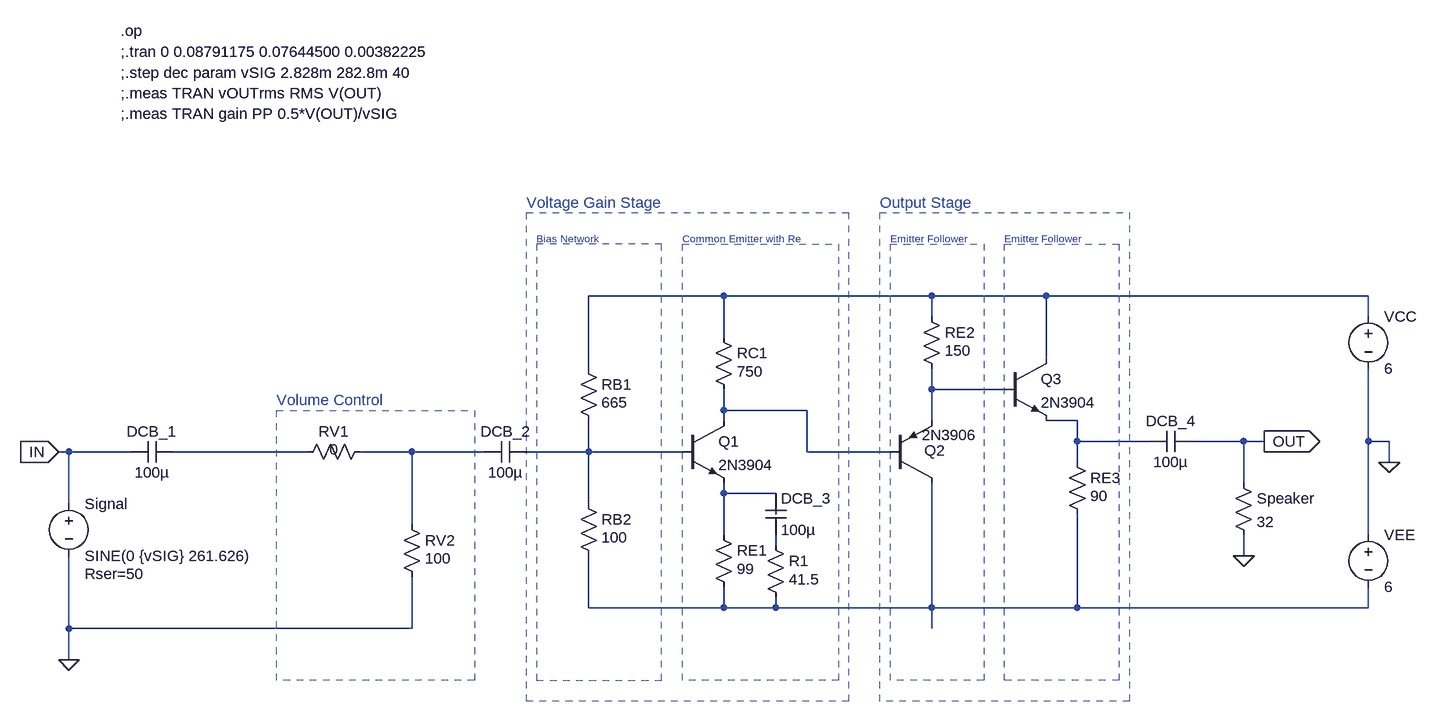
[diagram p0: schematic LabeledAudioAmplifier.asc]
LabeledAudioAmplifier.asc, the LTspice schematic file:
Version 4
SHEET 1 2440 680
WIRE 608 -272 400 -272
WIRE 928 -272 608 -272
WIRE 1104 -272 928 -272
WIRE 1600 -272 1104 -272
WIRE 928 -240 928 -272
WIRE 1600 -240 1600 -272
WIRE 608 -208 608 -272
WIRE 1104 -176 1104 -272
WIRE 400 -160 400 -272
WIRE 928 -128 928 -160
WIRE 1040 -128 928 -128
WIRE 608 -96 608 -128
WIRE 736 -96 608 -96
WIRE 608 -80 608 -96
WIRE 928 -80 928 -128
WIRE 1152 -80 1104 -80
WIRE 1152 -48 1152 -80
WIRE 1264 -48 1152 -48
WIRE 1408 -48 1328 -48
WIRE 1440 -48 1408 -48
WIRE 1600 -48 1600 -160
WIRE 1632 -48 1600 -48
WIRE -400 -32 -416 -32
WIRE -304 -32 -400 -32
WIRE -32 -32 -240 -32
WIRE 128 -32 48 -32
WIRE 240 -32 128 -32
WIRE 400 -32 400 -80
WIRE 400 -32 304 -32
WIRE 544 -32 400 -32
WIRE 736 -32 736 -96
WIRE 864 -32 736 -32
WIRE 1152 -16 1152 -48
WIRE 1632 -16 1632 -48
WIRE 1408 16 1408 -48
WIRE 608 32 608 16
WIRE 688 32 608 32
WIRE -400 48 -400 -32
WIRE 400 48 400 -32
WIRE 688 64 688 48
WIRE 128 80 128 -32
WIRE 608 96 608 32
WIRE 1600 96 1600 -48
WIRE 688 112 688 96
WIRE 1408 128 1408 96
WIRE 400 208 400 128
WIRE 608 208 608 176
WIRE 608 208 400 208
WIRE 688 208 688 192
WIRE 688 208 608 208
WIRE 928 208 928 16
WIRE 928 208 688 208
WIRE 1152 208 1152 64
WIRE 1152 208 928 208
WIRE 1600 208 1600 176
WIRE 1600 208 1152 208
WIRE -400 240 -400 128
WIRE 128 240 128 160
WIRE 128 240 -400 240
WIRE 928 240 928 208
WIRE -400 288 -400 240
FLAG -400 288 0
FLAG 1440 -48 OUT
IOPIN 1440 -48 Out
FLAG -416 -32 IN
IOPIN -416 -32 In
FLAG 1632 -16 0
FLAG 1408 128 0
SYMBOL voltage 1600 -256 R0
WINDOW 123 0 0 Left 0
WINDOW 39 0 0 Left 0
SYMATTR InstName VCC
SYMATTR Value 6
SYMBOL cap 304 -48 R90
WINDOW 0 0 32 VBottom 2
WINDOW 3 32 32 VTop 2
SYMATTR InstName DCB_2
SYMATTR Value 100µ
SYMBOL res 384 -176 R0
WINDOW 3 36 68 Left 2
SYMATTR Value 665
SYMATTR InstName RB1
SYMBOL res 384 32 R0
WINDOW 3 36 68 Left 2
SYMATTR Value 100
SYMATTR InstName RB2
SYMBOL res 1136 -32 R0
WINDOW 3 36 68 Left 2
SYMATTR Value 90
SYMATTR InstName RE3
SYMBOL res 1392 0 R0
SYMATTR InstName Speaker
SYMATTR Value 32
SYMBOL voltage -400 32 R0
WINDOW 123 0 0 Left 2
WINDOW 39 24 124 Left 2
SYMATTR SpiceLine Rser=50
SYMATTR InstName Signal
SYMATTR Value SINE(0 {vSIG} 261.626)
SYMBOL cap 1328 -64 R90
WINDOW 0 0 32 VBottom 2
WINDOW 3 32 32 VTop 2
SYMATTR InstName DCB_4
SYMATTR Value 100µ
SYMBOL res 112 64 R0
WINDOW 3 36 68 Left 2
SYMATTR Value 100
SYMATTR InstName RV2
SYMBOL res 64 -48 R90
WINDOW 0 0 56 VBottom 2
WINDOW 3 28 56 VBottom 2
SYMATTR InstName RV1
SYMATTR Value 0
SYMBOL cap -240 -48 R90
WINDOW 0 0 32 VBottom 2
WINDOW 3 32 32 VTop 2
SYMATTR InstName DCB_1
SYMATTR Value 100µ
SYMBOL res 592 80 R0
WINDOW 3 36 68 Left 2
SYMATTR Value 99
SYMATTR InstName RE1
SYMBOL res 672 96 R0
WINDOW 3 36 68 Left 2
SYMATTR Value 41.5
SYMATTR InstName R1
SYMBOL cap 672 32 R0
SYMATTR InstName DCB_3
SYMATTR Value 100µ
SYMBOL res 592 -224 R0
WINDOW 3 36 68 Left 2
SYMATTR Value 750
SYMATTR InstName RC1
SYMBOL res 912 -256 R0
WINDOW 3 36 68 Left 2
SYMATTR Value 150
SYMATTR InstName RE2
SYMBOL npn 544 -80 R0
SYMATTR InstName Q1
SYMATTR Value 2N3904
SYMBOL npn 1040 -176 R0
SYMATTR InstName Q3
SYMATTR Value 2N3904
SYMBOL pnp 864 16 M180
WINDOW 0 53 50 Left 2
WINDOW 3 49 74 Left 2
SYMATTR InstName Q2
SYMATTR Value 2N3906
SYMBOL voltage 1600 80 R0
WINDOW 123 0 0 Left 0
WINDOW 39 0 0 Left 0
SYMATTR InstName VEE
SYMATTR Value 6
TEXT -320 -616 Left 2 !;.step dec param vSIG 2.828m 282.8m 40
TEXT -320 -648 Left 2 !;.tran 0 0.08791175 0.07644500 0.00382225
TEXT -320 -584 Left 2 !;.meas TRAN vOUTrms RMS V(OUT)\n;.meas TRAN gain PP 0.5*V(OUT)/vSIG
TEXT -320 -680 Left 2 !.op
TEXT -80 -112 Left 2 ;Volume Control
TEXT 320 -360 Left 1 ;Bias Network
TEXT 544 -360 Left 1 ;Common Emitter with Re
TEXT 864 -360 Left 1 ;Emitter Follower
TEXT 1040 -360 Left 1 ;Emitter Follower
TEXT 304 -416 Left 2 ;Voltage Gain Stage
TEXT 848 -416 Left 2 ;Output Stage
RECTANGLE Normal 224 320 -80 -96 2
RECTANGLE Normal 320 320 512 -352 2
RECTANGLE Normal 784 320 544 -352 2
RECTANGLE Normal 1008 320 864 -352 2
RECTANGLE Normal 1216 320 1040 -352 2
RECTANGLE Normal 800 352 304 -400 2
RECTANGLE Normal 1232 352 848 -400 2

The netlist it stands for:
* LabeledAudioAmplifier.asc
VCC N001 0 6
C§DCB_2 N007 N006 100µ
RB1 N001 N007 665
RB2 N007 N011 100
RE3 N004 N011 90
R§Speaker OUT 0 32
V§Signal IN 0 SINE(0 {vSIG} 261.626) Rser=50
C§DCB_4 OUT N004 100µ
RV2 N006 0 100
RV1 N006 N005 0
C§DCB_1 N005 IN 100µ
RE1 N008 N011 99
R1 N010 N011 41.5
C§DCB_3 N008 N010 100µ
RC1 N001 N003 750
RE2 N001 N002 150
Q1 N003 N007 N008 0 2N3904
Q3 N001 N002 N004 0 2N3904
Q2 N011 N003 N002 0 2N3906
VEE 0 N011 6
.model NPN NPN
.model PNP PNP
.lib standard.bjt
;.step dec param vSIG 2.828m 282.8m 40
;.tran 0 0.08791175 0.07644500 0.00382225
;.meas TRAN vOUTrms RMS V(OUT)
;.meas TRAN gain PP 0.5*V(OUT)/vSIG
.op
* Volume Control
* Bias Network
* Common Emitter with Re
* Emitter Follower
* Emitter Follower
* Voltage Gain Stage
* Output Stage
.backanno
.end